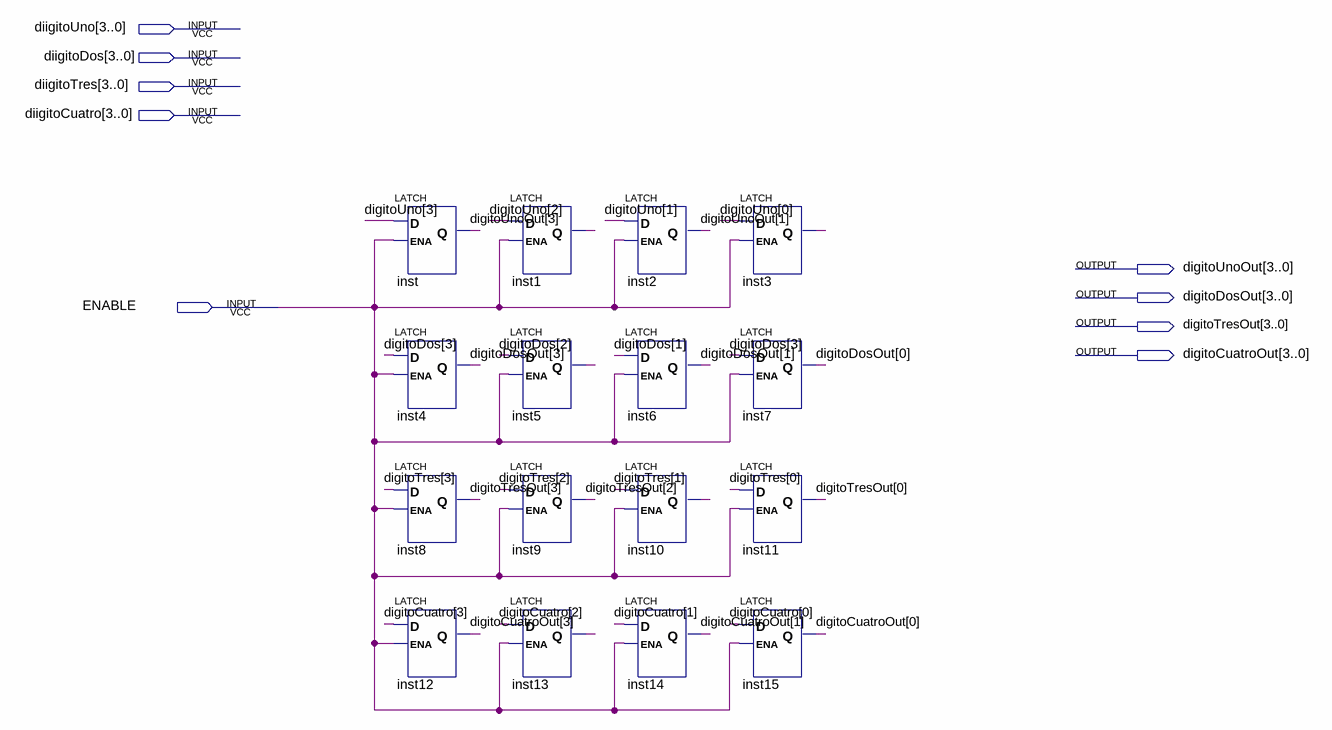
[diagram p0: schematic sheet]
// Quartus schematic registroCedula.bdf as structural Verilog: 16 symbols, 9 pins
module registroCedula (
  input  [3:0] diigitoUno,
  input  [3:0] diigitoDos,
  input  [3:0] diigitoTres,
  input  [3:0] diigitoCuatro,
  input  ENABLE,
  output [3:0] digitoUnoOut,
  output [3:0] digitoDosOut,
  output [3:0] digitoTresOut,
  output [3:0] digitoCuatroOut
);

  wire inst1_q, inst3_q, inst5_q, inst10_q, inst13_q;
  wire [3:0] digitoCuatro, digitoTres, digitoUno;
  wire [3:1] digitoDos;

  LATCH inst (.D(digitoUno[3]), .ENA(ENABLE), .Q(digitoUnoOut[3]));
  LATCH inst4 (.D(digitoDos[3]), .ENA(ENABLE), .Q(digitoDosOut[3]));
  LATCH inst8 (.D(digitoTres[3]), .ENA(ENABLE), .Q(digitoTresOut[3]));
  LATCH inst12 (.D(digitoCuatro[3]), .ENA(ENABLE), .Q(digitoCuatroOut[3]));
  LATCH inst1 (.D(digitoUno[2]), .ENA(ENABLE), .Q(inst1_q));
  LATCH inst5 (.D(digitoDos[2]), .ENA(ENABLE), .Q(inst5_q));
  LATCH inst9 (.D(digitoTres[2]), .ENA(ENABLE), .Q(digitoTresOut[2]));
  LATCH inst13 (.D(digitoCuatro[2]), .ENA(ENABLE), .Q(inst13_q));
  LATCH inst2 (.D(digitoUno[1]), .ENA(ENABLE), .Q(digitoUnoOut[1]));
  LATCH inst6 (.D(digitoDos[1]), .ENA(ENABLE), .Q(digitoDosOut[1]));
  LATCH inst10 (.D(digitoTres[1]), .ENA(ENABLE), .Q(inst10_q));
  LATCH inst14 (.D(digitoCuatro[1]), .ENA(ENABLE), .Q(digitoCuatroOut[1]));
  LATCH inst3 (.D(digitoUno[0]), .ENA(ENABLE), .Q(inst3_q));
  LATCH inst7 (.D(digitoDos[3]), .ENA(ENABLE), .Q(digitoDosOut[0]));
  LATCH inst11 (.D(digitoTres[0]), .ENA(ENABLE), .Q(digitoTresOut[0]));
  LATCH inst15 (.D(digitoCuatro[0]), .ENA(ENABLE), .Q(digitoCuatroOut[0]));
endmodule
